# Altium schematic sheet VR Interfaces.SchDoc: Ravage - VR Interfaces
size A4; Address1: Drawn By:; Address2: Dan Visser; DocumentNumber: A; Revision: 0.1-alpha; SheetNumber: 5; SheetTotal: 16
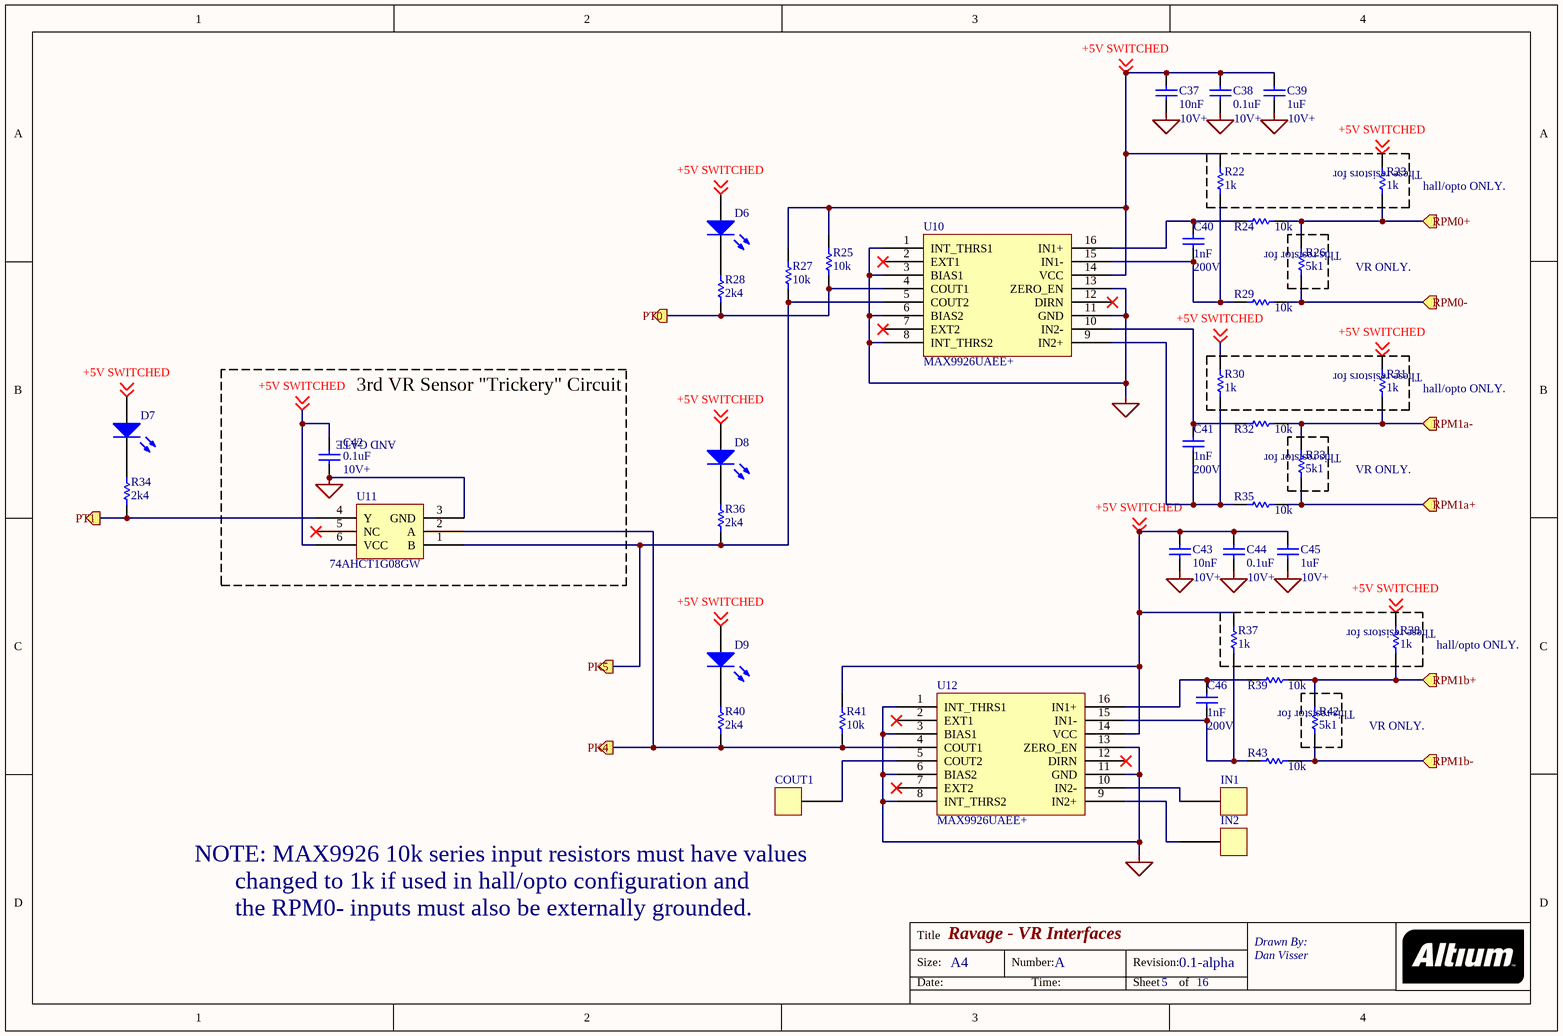
[diagram p0: VR Interfaces.SchDoc]

## Parts
C37  value 10nF  [RAD-0.3]
C38  value 0.1uF  [RAD-0.3]
C39  value 1uF  [RAD-0.3]
C40  value 1nF  [RAD-0.3]
C41  value 1nF  [RAD-0.3]
C42  value 0.1uF  [RAD-0.3]
C43  value 10nF  [RAD-0.3]
C44  value 0.1uF  [RAD-0.3]
C45  value 1uF  [RAD-0.3]
C46  value 1nF  [RAD-0.3]
COUT1  (no value)
D6  (no value)  [LED-0]
D7  (no value)  [LED-0]
D8  (no value)  [LED-0]
D9  (no value)  [LED-0]
IN1  (no value)
IN2  (no value)
R22  value 1k  [AXIAL-0.3]
R23  value 1k  [AXIAL-0.3]
R24  value 10k  [AXIAL-0.3]
R25  value 10k  [AXIAL-0.3]
R26  value 5k1  [AXIAL-0.3]
R27  value 10k  [AXIAL-0.3]
R28  value 2k4  [AXIAL-0.3]
R29  value 10k  [AXIAL-0.3]
R30  value 1k  [AXIAL-0.3]
R31  value 1k  [AXIAL-0.3]
R32  value 10k  [AXIAL-0.3]
R33  value 5k1  [AXIAL-0.3]
R34  value 2k4  [AXIAL-0.3]
R35  value 10k  [AXIAL-0.3]
R36  value 2k4  [AXIAL-0.3]
R37  value 1k  [AXIAL-0.3]
R38  value 1k  [AXIAL-0.3]
R39  value 10k  [AXIAL-0.3]
R40  value 2k4  [AXIAL-0.3]
R41  value 10k  [AXIAL-0.3]
R42  value 5k1  [AXIAL-0.3]
R43  value 10k  [AXIAL-0.3]
U10  MAX9926UAEE+
U11  74AHCT1G08GW
U12  MAX9926UAEE+

## Blocks framed on the sheet
3rd VR Sensor "Trickery" Circuit: C42 U11

## Ports
PK4 (out), PK5 (out), PT0 (out), PT1 (out), RPM0+ (in), RPM0- (in), RPM1a+ (in), RPM1a- (in), RPM1b+ (in), RPM1b- (in)

## Nets
NetC37_1: C37.1 C38.1 C39.1 C42.1 C43.1 C44.1 C45.1 U10.1(INT_THRS1) U10.3(BIAS1) U10.6(BIAS2) U10.8(INT_THRS2) U10.11(GND) U10.13(ZERO_EN) U11.3(GND) U12.1(INT_THRS1) U12.3(BIAS1) U12.6(BIAS2) U12.8(INT_THRS2) U12.11(GND) U12.13(ZERO_EN)
+5V SWITCHED: C37.2 C38.2 C39.2 C42.2 C43.2 C44.2 C45.2 D6.1(A) D7.1(A) D8.1(A) D9.1(A) R22.2 R23.2 R25.2 R27.2 R30.2 R31.2 R37.2 R38.2 R41.2 U10.14(VCC) U11.6(VCC) U12.14(VCC) ; off-sheet +5V SWITCHED
PK4: R40.1 R41.1 U11.2(A) U12.4(COUT1) ; port PK4
PK5: R27.1 R36.1 U10.5(COUT2) U11.1(B) ; port PK5
PT0: R25.1 R28.1 U10.4(COUT1) ; port PT0
PT1: R34.1 U11.4(Y) ; port PT1
RPM0+: R23.1 R24.2 R26.2 ; port RPM0+
RPM0-: R26.1 R29.2 ; port RPM0-
RPM1a+: R33.1 R35.2 ; port RPM1a+
RPM1a-: R31.1 R32.2 R33.2 ; port RPM1a-
RPM1b+: R38.1 R39.2 R42.2 ; port RPM1b+
RPM1b-: R42.1 R43.2 ; port RPM1b-
NetC40_1: C40.1 R22.1 R29.1 U10.15(IN1-)
NetC40_2: C40.2 R24.1 U10.16(IN1+)
NetC41_1: C41.1 R30.1 R35.1 U10.9(IN2+)
NetC41_2: C41.2 R32.1 U10.10(IN2-)
NetC46_1: C46.1 R37.1 R43.1 U12.15(IN1-)
NetC46_2: C46.2 R39.1 U12.16(IN1+)
NetCOUT1_1: COUT1.1 U12.5(COUT2)
NetD6_2: D6.2(K) R28.2
NetD7_2: D7.2(K) R34.2
NetD8_2: D8.2(K) R36.2
NetD9_2: D9.2(K) R40.2
NetIN1_1: IN1.1 U12.10(IN2-)
NetIN2_1: IN2.1 U12.9(IN2+)

Not connected (* = marked no-connect by the designer): U10 2(EXT1)* 7(EXT2)* 12(DIRN)*; U11 5(NC)*; U12 2(EXT1)* 7(EXT2)* 12(DIRN)*

## Notes on the sheet
- 10V+
- (near C39) 10V+
- (near R23) These resistors for
- This resistor for
- (near R23) hall/opto ONLY.
- (near C40) 200V
- VR ONLY.
- (near R31) These resistors for
- AND GATE
- (near R31) hall/opto ONLY.
- (near C42) 10V+
- (near C41) 200V
- (near C45) 10V+
- (near R38) These resistors for
- (near R38) hall/opto ONLY.
- (near C46) 200V
- NOTE: MAX9926 10k series input resistors must have values
- changed to 1k if used in hall/opto configuration and
- the RPM0- inputs must also be externally grounded.
- Title
- Size:
- Date:
- A4
- Number:
- Time:
- Revision:
- Sheet
- of

## Library data of the parts
C37-C46 = Cap: Capacitor; Published: 8-Jun-2000; LatestRevisionDate: 17-Jul-2002; LatestRevisionNote: Re-released for DXP Platform.; PackageReference: RAD-0.3; Publisher: Altium Limited; PackageDescription: Radial Cap, Thru-Hole; 2 Leads; 0.3 in Pin Spacing
COUT1 IN1 IN2 = HEADER 1
D6-D9 = LED0: Typical INFRARED GaAs LED; Published: 8-Jun-2000; LatestRevisionDate: 08-Jul-2005; LatestRevisionNote: Mech Layer 1 removed.; PackageReference: LED-0; Publisher: Altium Limited; PackageDescription: LED; 2 Leads
R22-R43 = Res1: Resistor; Published: 8-Jun-2000; LatestRevisionDate: 17-Jul-2002; LatestRevisionNote: Re-released for DXP Platform.; PackageReference: AXIAL-0.3; Publisher: Altium Limited; PackageDescription: Axial Device, Thru-Hole; 2 Leads; 0.3 in Pin Spacing
U11 = NC7SZ32P5X